# EAGLE design BLEak (EAGLE 7.1.0)
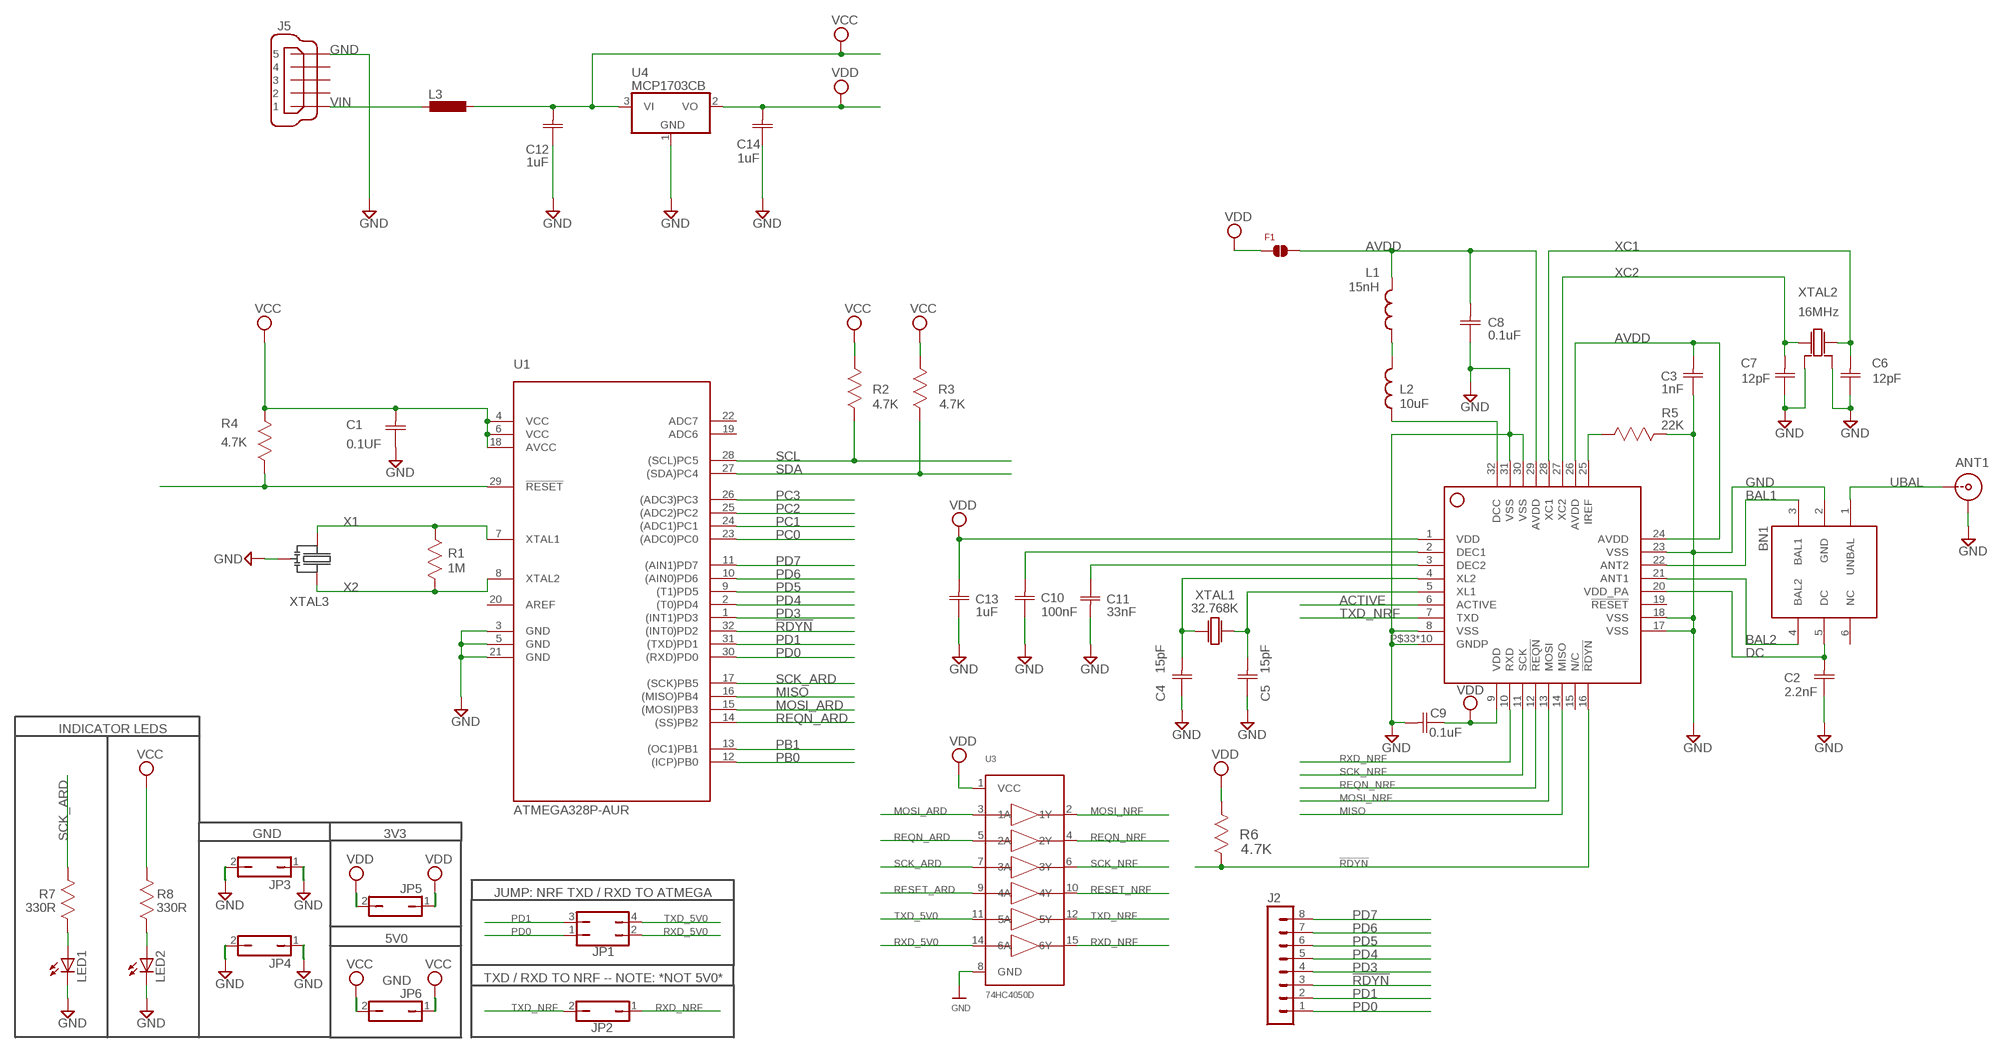
[diagram p0: schematic, sheet 1]

## Parts
ANT1  U.FL-R-SMT(01)  [U.FL]
BN1  2450BM14A0002  [BALUN]
C1  0.1UF  0603ZC104KA72A  [CAPC1608X90N]
C2  2.2nF  C0603C222K5RACTU  [CAPC1608X85N]
C3  1nF  C0603C102J5GACTU  [CAPC1608X85N]
C4  15pF  C0603C150J5GACTU  [CAPC1608X85N]
C5  15pF  C0603C150J5GACTU  [CAPC1608X85N]
C6  12pF  C0603C120J5GACTU  [CAPC1608X85N]
C7  12pF  C0603C120J5GACTU  [CAPC1608X85N]
C8  0.1uF  0603YC104K4T4A  [CAPC1608X90N]
C9  0.1uF  0603YC104K4T4A  [CAPC1608X90N]
C10  100nF  06033C104JAT2A  [CAPC1608X90N]
C11  33nF  C0603C333K5RACTU  [CAPC1608X85N]
C12  1uF  C0805C105K3RACTU  [CAPC2013X140N]
C13  1uF  0603YD105MAT4A  [CAPC1608X90N]
C14  1uF  C0805C105K3RACTU  [CAPC2013X140N]
F1  MMZ1608B121C  [0603]
J2  MA08-1  [MA08-1]
J5  MINI-USB-UX60A-MB-5ST  [UX60A-MB-5ST]
JP1  JP2Q  [JP2Q]
JP2  JP1Q  [JP1]
JP3  JP1Q  [JP1]
JP4  JP1Q  [JP1]
JP5  JP1Q  [JP1]
JP6  JP1Q  [JP1]
L1  15nH  HK100515NJ-T  [0402]
L2  10uF  LBMF1608T100K  [0603]
L3  L-EUL1812  [L1812]
LED1  LEDCHIP-LED0603  [CHIP-LED0603]
LED2  LEDCHIP-LED0603  [CHIP-LED0603]
R1  1M  MC0.063W06031%1M  [RESC1608X60N]
R2  4.7K  MC0.063W06031%4K7  [RESC1608X60N]
R3  4.7K  MC0.063W06031%4K7  [RESC1608X60N]
R4  4.7K  MC0.063W06031%4K7  [RESC1608X60N]
R5  22K  MC0.063W06031%22K  [RESC1608X60N]
R6  4.7K  MC0.063W06031%4K7  [RESC1608X60N]
R7  330R  MC0.063W06031%330R  [RESC1608X60N]
R8  330R  MC0.063W06031%330R  [RESC1608X60N]
U1  ATMEGA328P-AUR  [TQFP-32]
U2  NRF8001  [QFN50P500X500X90-33N]
U3  74HC4050D  74HC4050DTSSOP  [TSSOP16]
U4  MCP1703CB  [SOT23]
XTAL1  32.768K  NX3215SA-32.768K-STD-MUA-9  [3215]
XTAL2  16MHz  TSX-3225-16.0000MF18X-AC3  [3225]
XTAL3  CSTCE16M0V53-R0  [CSTCE16M0V53-R0]

## Nets
!RDYN: J2.3 R6.2(R2) U1.32((INT0)PD2) U2.16(!RDYN)
ACTIVE: U2.6(ACTIVE)
AVDD: C3.2(C2) C8.2(C2) F1.P$2 L1.P$2 U2.24(AVDD) U2.26(AVDD) U2.29(AVDD)
BAL1: BN1.3(BAL1) U2.22(ANT2)
BAL2: BN1.4(BAL2) U2.21(ANT1)
DC: BN1.5(DC) C2.2(C2) U2.20(VDD_PA)
GND: ANT1.2 ANT1.3 BN1.2(GND) C1.1(C1) C2.1(C1) C3.1(C1) C4.1(C1) C5.1(C1) C6.1(C1) C7.1(C1) C8.1(C1) C9.2(C2) C10.1(C1) C11.2(C2) C12.1(C1) C13.1(C1) C14.1(C1) J5.5 JP3.1 JP3.2 JP4.1 JP4.2 LED1.C LED2.C R5.1(R1) U1.3(GND) U1.5(GND) U1.21(GND) U2.8(VSS) U2.17(VSS) U2.18(VSS) U2.23(VSS) U2.30(VSS) U2.31(VSS) U2.P$33(GNDP) U2.P$34(GNDP) U2.P$35(GNDP) U2.P$36(GNDP) U2.P$37(GNDP) U2.P$38(GNDP) U2.P$39(GNDP) U2.P$40(GNDP) U2.P$41(GNDP) U2.P$42(GNDP) U3.8(GND) U4.1(GND) XTAL2.2 XTAL2.4 XTAL3.2
MISO: U1.16((MISO)PB4) U2.14(MISO)
MOSI_ARD: U1.15((MOSI)PB3) U3.3(1A)
MOSI_NRF: U2.13(MOSI) U3.2(1Y)
N$1: R4.2(R2) U1.29(!RESET)
N$4: R5.2(R2) U2.25(IREF)
N$5: C4.2(C2) U2.4(XL2) XTAL1.2
N$7: C5.2(C2) U2.5(XL1) XTAL1.1
N$11: L1.P$1 L2.2
N$12: L2.1 U2.32(DCC)
N$14: C11.1(C1) U2.3(DEC2)
N$15: C10.2(C2) U2.2(DEC1)
N$21: LED2.A R8.2(R2)
N$22: LED1.A R7.2(R2)
PB0: U1.12((ICP)PB0)
PB1: U1.13((OC1)PB1)
PC0: U1.23((ADC0)PC0)
PC1: U1.24((ADC1)PC1)
PC2: U1.25((ADC2)PC2)
PC3: U1.26((ADC3)PC3)
PD0: J2.1 JP1.1 U1.30((RXD)PD0)
PD1: J2.2 JP1.3 U1.31((TXD)PD1)
PD3: J2.4 U1.1((INT1)PD3)
PD4: J2.5 U1.2((T0)PD4)
PD5: J2.6 U1.9((T1)PD5)
PD6: J2.7 U1.10((AIN0)PD6)
PD7: J2.8 U1.11((AIN1)PD7)
REQN_ARD: U3.5(2A)
REQN_NRF: U2.12(!REQN) U3.4(2Y)
RESET_ARD: U3.9(4A)
RESET_NRF: U3.10(4Y)
RXD_5V0: JP1.2 U3.14(6A)
RXD_NRF: JP2.1 U2.10(RXD) U3.15(6Y)
SCK_ARD: R7.1(R1) U1.17((SCK)PB5) U3.7(3A)
SCK_NRF: U2.11(SCK) U3.6(3Y)
SCL: R2.2(R2) U1.28((SCL)PC5)
SDA: R3.2(R2) U1.27((SDA)PC4)
TXD_5V0: JP1.4 U3.11(5A)
TXD_NRF: JP2.2 U2.7(TXD) U3.12(5Y)
UBAL: ANT1.1 BN1.1(UNBAL)
VCC: C1.2(C2) C12.2(C2) JP6.1 JP6.2 L3.1 R2.1(R1) R3.1(R1) R4.1(R1) R8.1(R1) U1.4(VCC) U1.6(VCC) U1.18(AVCC) U4.3(VI)
VDD: C9.1(C1) C13.2(C2) C14.2(C2) F1.P$1 JP5.1 JP5.2 R6.1(R1) U2.1(VDD) U2.9(VDD) U3.1(VCC) U4.2(VO)
VIN: J5.1 L3.2
X1: R1.2(R2) U1.7(XTAL1) XTAL3.1
X2: R1.1(R1) U1.8(XTAL2) XTAL3.3
XC1: C6.2(C2) U2.28(XC1) XTAL2.3
XC2: C7.2(C2) U2.27(XC2) XTAL2.1
Unconnected: BN1.6(NC) J5.2 J5.3 J5.4 U1.14((SS)PB2) U1.19(ADC6) U1.20(AREF) U1.22(ADC7) U2.15(N/C) U2.19(!RESET)

## Notes on the sheet
- INDICATOR LEDS
- GND | 3V3
- JUMP: NRF TXD / RXD TO ATMEGA
- 5V0
- GND | TXD / RXD TO NRF -- NOTE: *NOT 5V0*

## Library data of the parts
ANT1 = U.FL-R-SMT(01):U.FL-R-SMT(01); MANUFACTURER: HIROSE; PARTNO: U.FL-R-SMT(01)
BN1 = 2450BM14A0002:2450BM14A0002; MANUFACTURER: JOHANSON; PARTNO: 2450BM14A0002
C1 = AVX:0603ZC104KA72A: Capacitor, 0603; MPN: 0603ZC104KA72A; OC_FARNELL: -; OC_NEWARK: 55J2765; SUPPLIER: AVX; TOLERANCE: ±10%; VOLTAGERATING: 10V
C2 = Kemet:C0603C222K5RACTU: CAPACITOR, 0603; MPN: C0603C222K5RACTU; OC_FARNELL: 1414624; OC_NEWARK: 64K2852; SUPPLIER: Kemet; TOLERANCE: ±10%; VOLTAGERATING: 50V
C3 = Kemet:C0603C102J5GACTU: CAPACITOR, 0603; MPN: C0603C102J5GACTU; OC_FARNELL: 1414605; OC_NEWARK: 86H9967; SUPPLIER: Kemet; TOLERANCE: ±5%; VOLTAGERATING: 50V
C4 C5 = Kemet:C0603C150J5GACTU: CAPACITOR, 0603; MPN: C0603C150J5GACTU; OC_FARNELL: 1414614; OC_NEWARK: 70K9092; SUPPLIER: Kemet; TOLERANCE: ±5%; VOLTAGERATING: 50V
C6 C7 = Kemet:C0603C120J5GACTU: CAPACITOR, 0603; MPN: C0603C120J5GACTU; OC_FARNELL: 1414612; OC_NEWARK: 19C1214; SUPPLIER: Kemet; TOLERANCE: ±5%; VOLTAGERATING: 50V
C8 C9 = AVX:0603YC104K4T4A: Capacitor, 0603; MPN: 0603YC104K4T4A; OC_FARNELL: 1833863; OC_NEWARK: 85R5663; SUPPLIER: AVX; TOLERANCE: ±10%; VALUE: 0.1UF; VOLTAGERATING: 16V
C10 = AVX:06033C104JAT2A: Capacitor 0603; MPN: 06033C104JAT2A; OC_FARNELL: 1740614; OC_NEWARK: 60R6215; SUPPLIER: AVX; TOLERANCE: ±5%; VOLTAGERATING: 25V
C11 = Kemet:C0603C333K5RACTU: CAPACITOR, 0603; MPN: C0603C333K5RACTU; OC_FARNELL: 1414636; OC_NEWARK: 53M7207; SUPPLIER: Kemet; TOLERANCE: ±10%; VOLTAGERATING: 50V
C12 C14 = Kemet_By_element14_Batch_1:C0805C105K3RACTU: CAPACITOR, 0805; MPN: C0805C105K3RACTU; OC_FARNELL: 1637035; OC_NEWARK: 93K6001; SUPPLIER: Kemet; TOLERANCE: ±10%; VOLTAGERATING: 25V
C13 = AVX:0603YD105MAT4A: Capacitor, 0603; MPN: 0603YD105MAT4A; OC_FARNELL: -; OC_NEWARK: 55J2728; SUPPLIER: AVX; TOLERANCE: ±20%; VALUE: 1UF; VOLTAGERATING: 16V
F1 = MMZ1608B121C:MMZ1608B121C
J2 = con-lstb:MA08-1: PIN HEADER; OC_FARNELL: unknown; OC_NEWARK: unknown
J5 = con-hirose:MINI-USB-: MINI USB Connector Source: http://www.hirose.co.jp/cataloge_hp/e24000019.pdf; OC_FARNELL: unknown; OC_NEWARK: unknown
JP1 = jumper:JP2Q: JUMPER
JP2-JP6 = jumper:JP1Q: JUMPER
L1 = HK100515NJ-T:HK100515NJ-T
L2 = IND:LBMF1608T100K
L3 = rcl:L-EU: INDUCTOR, European symbol
LED1 LED2 = led:LED: LED OSRAM: - CHIPLED LG R971, LG N971, LY N971, LG Q971, LY Q971, LO R971, LY R971 LH N974, LH R974 LS Q976, LO Q976, LY Q976 LO Q996 - Hyper CHIPLED LW Q18S LB Q993, LB Q99A, LB R99A - SideLED LS A670, LO A670, LY A670, LG A670, LP A670 LB A673, LV A673, LT A673, LW A673 LH A674 LY A675 LS A676, LA A676, LO A676, LY A676, LW A676 LS A679, LY A679, LG A679 - Hyper Micro SIDELED® LS Y876, LA Y876, LO Y876, LY Y876 LT Y87S - SmartLED LW L88C, LW L88S LB L89C, LB L89S, LG L890 LS L89K, LO L89K, LY L89K LS L896, LA L896, LO L896, LY L896 - TOPLED LS T670, LO T670, LY T670, LG T670, LP T670 LSG T670, LSP T670, LSY T670, LOP T670, LYG T670 LG T671, LOG T671, LSG T671 LB T673, LV T673, LT T673, LW T673 LH T674 LS T676, LA T676, LO T676, LY T676, LB T676, LH T676, LSB T676, LW T676 LB T67C, LV T67C, LT T67C, LS T67K, LO T67K, LY T67K, LW E67C LS E67B, LA E67B, LO E67B, LY E67B, LB E67C, LV E67C, LT E67C LW T67C LS T679, LY T679, LG T679 LS T770, LO T770, LY T770, LG T770, LP T770 LB T773, LV T773, LT T773, LW T773 LH T774 LS E675, LA E675, LY E675, LS T675 LS T776, LA T776, LO T776, LY T776, LB T776 LHGB T686 LT T68C, LB T68C - Hyper Mini TOPLED® LB M676 - Mini TOPLED Santana® LG M470 LS M47K, LO M47K, LY M47K Source: http://www.osram.convergy.de LUXEON: - LUMILED® LXK2-PW12-R00, LXK2-PW12-S00, LXK2-PW14-U00, LXK2-PW14-V00 LXK2-PM12-R00, LXK2-PM12-S00, LXK2-PM14-U00 LXK2-PE12-Q00, LXK2-PE12-R00, LXK2-PE12-S00, LXK2-PE14-T00, LXK2-PE14-U00 LXK2-PB12-K00, LXK2-PB12-L00, LXK2-PB12-M00, LXK2-PB14-N00, LXK2-PB14-P00, LXK2-PB14-Q00 LXK2-PR12-L00, LXK2-PR12-M00, LXK2-PR14-Q00, LXK2-PR14-R00 LXK2-PD12-Q00, LXK2-PD12-R00, LXK2-PD12-S00 LXK2-PH12-R00, LXK2-PH12-S00 LXK2-PL12-P00, LXK2-PL12-Q00, LXK2-PL12-R00 Source: www.luxeon.com KINGBRIGHT: KA-3528ASYC Source: www.kingbright.com
R1 = Multicomp:MC0.063W06031%1M: RESISTOR, 0603; MPN: MC0.063W06031%1M; OC_FARNELL: 9330410; OC_NEWARK: 38K9946; SUPPLIER: Multicomp; TOLERANCE: 1%; VALUE: 1M Ohms; WATTAGE: 1/16 W
R2-R4 R6 = Multicomp:MC0.063W06031%4K7: RESISTOR, 0603; MPN: MC0.063W06031%4K7; OC_FARNELL: 9331247; OC_NEWARK: -; SUPPLIER: Multicomp; TOLERANCE: 1%; VALUE: 4.7K Ohms; WATTAGE: 1/16 W
R5 = Multicomp:MC0.063W06031%22K: RESISTOR, 0603; MPN: MC0.063W06031%22K; OC_FARNELL: 9330828; OC_NEWARK: 38K9987; SUPPLIER: Multicomp; TOLERANCE: ±1%; VALUE: 22K Ohms; WATTAGE: 1/16 W
R7 R8 = Multicomp:MC0.063W06031%330R: RESISTOR, 0603; MPN: MC0.063W06031%330R; OC_FARNELL: 9331018; OC_NEWARK: -; SUPPLIER: Multicomp; TOLERANCE: ±1%; VALUE: 330 Ohms; WATTAGE: 1/16 W
U1 = ATMEGA328P-AUR:ATMEGA328P-AUR: TQFP - High Performance, Low Power Atmel®AVR® 8-Bit Microcontroller Family; MANUFACTURER: ATMEL; PARTNO: ATMEGA328P-AUR
U2 = NRF8001:NRF8001; MANUFACTURER: NORDIC SEMICONDUCTOR; PARTNO: nRF8001
U3 = microbuilder:74HC4050D: 6-channel level shifter 74HC4050D - 2V-6V Supply SOIC16 Digikey: 74HC4050D,653-ND Mouser: 771-74HC4050D-T TSSOP16 Digikey: 296-9215-1-ND Mouser:
U4 = linear:MCP1703: 250 mA, 16V, Low Quiescent Current LDO Regulator Source: http://ww1.microchip.com/downloads/en/DeviceDoc/22049b.pdf
XTAL1 = XTAL:NX3215SA-32.768K-STD-MUA-9: 32.768K Crystal Oscillator
XTAL2 = XTAL-16MHZ:TSX-3225-16.0000MF18X-AC3: TSX-3225 16.0000MF18X-AC3 16MHz Crystal
XTAL3 = CSTCE16M0V53-R0:CSTCE16M0V53-R0

## Board
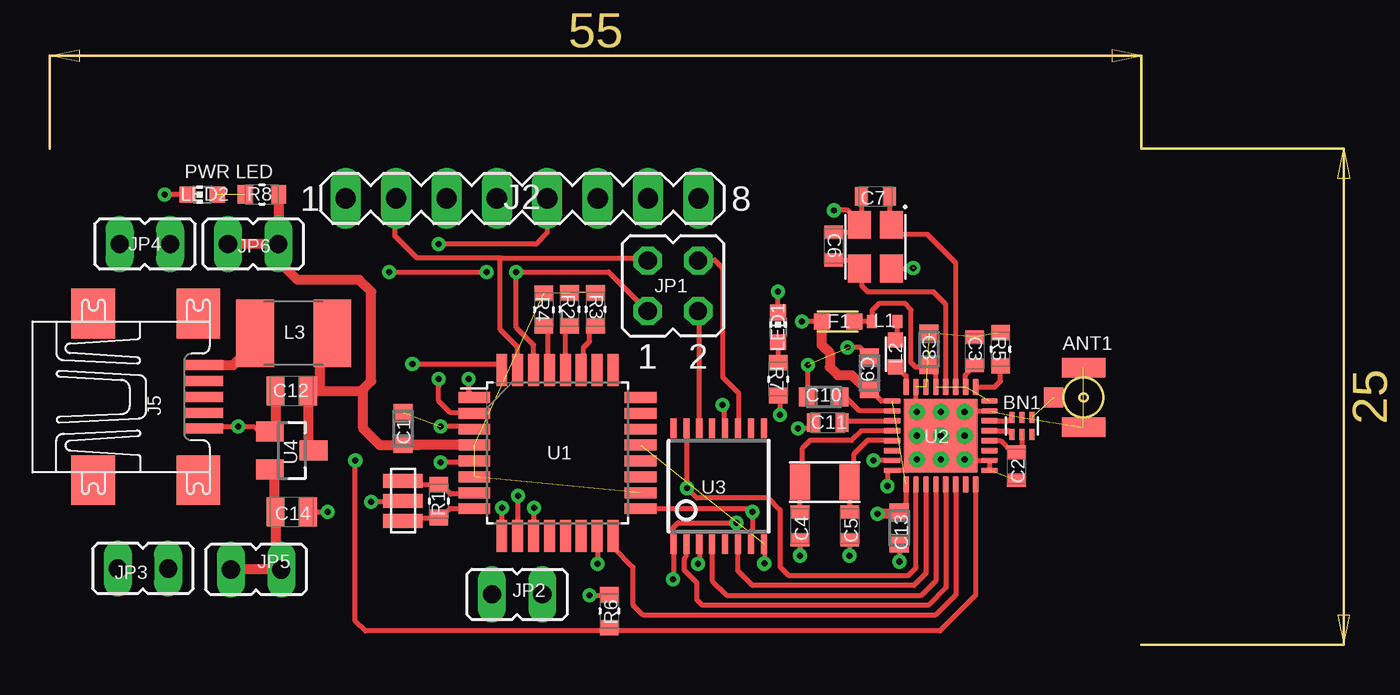
[diagram p1: board, top side]
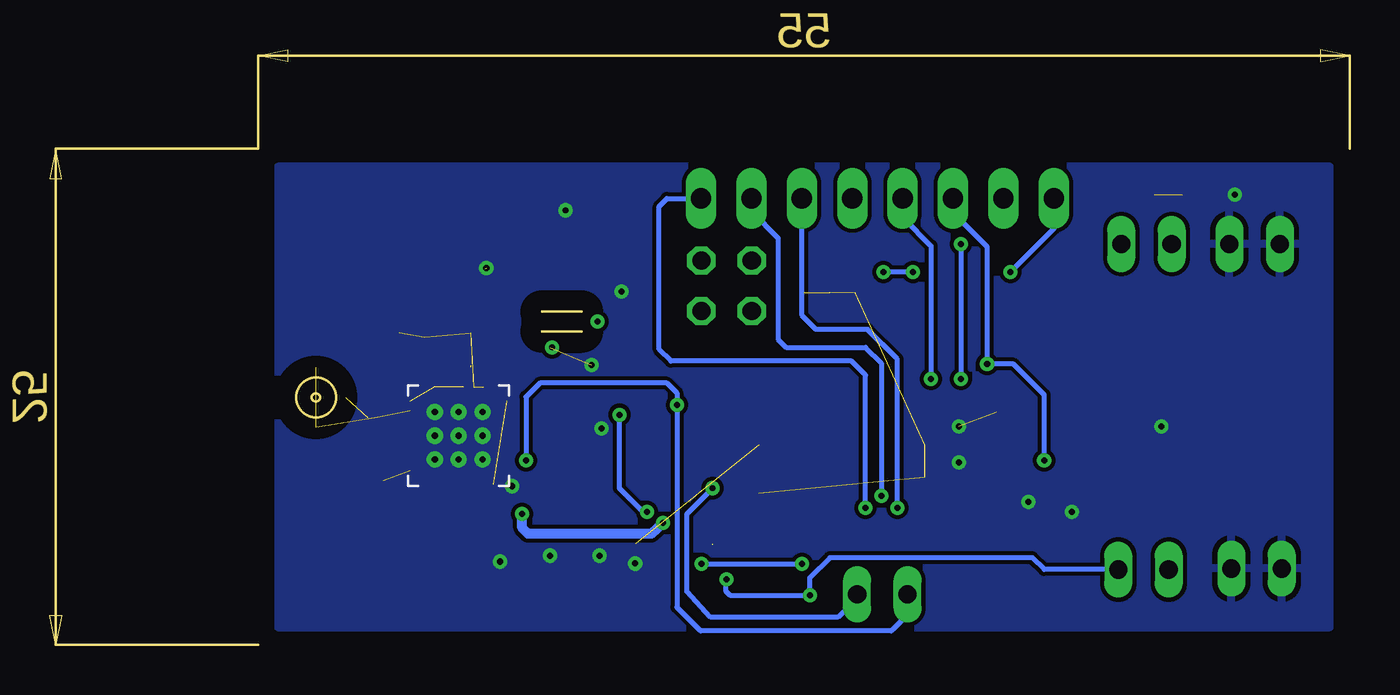
[diagram p2: board, bottom side, seen from below]

Size 14.38 x 5.33 mm. Coordinates in mm from the lower left corner, seen from the top.
Copper layers (1*16): Top 0.035mm / dielectric 1.5mm / Bottom 0.035mm
Design rules "default *": minimum track width 10mil, minimum drill 12mil, track to track 8mil, track to pad 5mil, pad to pad 5mil, via to via 8mil, smd to smd 5mil, copper to edge 40mil, drill to drill 8mil, minimum pad ring 10mil, minimum via ring 8mil, stop-mask expansion 4mil, vias tented up to drill 0mil, thermal gap 10mil

### Footprints (pad centres in the part's own frame; a part is rotated, then mirrored left to right if it is on the bottom)
U.FL = smd 1 x 1: 1 1.5,-1.5 | smd 1 x 2.2: 2 0,0; 3 3,0
BALUN = smd 0.55 x 0.25: 1 0,1; 2 0,0.5; 3 0,0; 4 0.85,0; 5 0.85,0.5; 6 0.85,1
CAPC1608X90N = smd 0.864 x 0.965: 1 -0.813,0; 2 0.813,0
CAPC1608X85N = smd 0.66 x 0.94: 1 -0.711,0; 2 0.711,0
CAPC2013X140N = smd 0.914 x 1.448: 1 -0.813,0; 2 0.813,0
0603 = smd 0.8 x 0.8: P$1 0,0; P$2 1.65,0
MA08-1 = drill 1.016 long: 1 -8.89,0; 2 -6.35,0; 3 -3.81,0; 4 -1.27,0; 5 1.27,0; 6 3.81,0; 7 6.35,0; 8 8.89,0
UX60A-MB-5ST = smd 2 x 0.5: 1 2.25,1.6; 2 2.25,0.8; 3 2.25,0; 4 2.25,-0.8; 5 2.25,-1.6 | smd 2.2 x 2.5: M1 -3.3,-4.2; M2 -3.3,4.2; M3 2,4.2; M4 2,-4.2
JP2Q = drill 0.914 octagon: 1 -1.27,-1.27; 2 1.27,-1.27; 3 -1.27,1.27; 4 1.27,1.27
JP1 = drill 0.914 long: 1 0,-1.27; 2 0,1.27
0402 = smd 0.508 x 0.635: P$1 0,0; P$2 1.27,0
0603' = smd 0.762 x 0.762: 1 0,0; 2 1.372,0
L1812 = smd 1.9 x 3.4: 1 -1.95,0; 2 1.95,0
CHIP-LED0603 = smd 0.8 x 0.8: A 0,-0.75; C 0,0.75
RESC1608X60N = smd 0.762 x 0.94: 1 -0.838,0; 2 0.838,0
TQFP-32 = smd 0.55 x 1.6: 1 -2.8,-4.18; 2 -2,-4.18; 3 -1.2,-4.18; 4 -0.4,-4.18; 5 0.4,-4.18; 6 1.2,-4.18; 7 2,-4.18; 8 2.8,-4.18; 17 2.8,4.18; 18 2,4.18; 19 1.2,4.18; 20 0.4,4.18; 21 -0.4,4.18; 22 -1.2,4.18; 23 -2,4.18; 24 -2.8,4.18 | smd 1.6 x 0.55: 9 4.18,-2.8; 10 4.18,-2; 11 4.18,-1.2; 12 4.18,-0.4; 13 4.18,0.4; 14 4.18,1.2; 15 4.18,2; 16 4.18,2.8; 25 -4.18,2.8; 26 -4.18,2; 27 -4.18,1.2; 28 -4.18,0.4; 29 -4.18,-0.4; 30 -4.18,-1.2; 31 -4.18,-2; 32 -4.18,-2.8
QFN50P500X500X90-33N = smd 0.85 x 0.3: 1 -2.45,1.75; 2 -2.45,1.25; 3 -2.45,0.75; 4 -2.45,0.25; 5 -2.45,-0.25; 6 -2.45,-0.75; 7 -2.45,-1.25; 8 -2.45,-1.75; 17 2.45,-1.75; 18 2.45,-1.25; 19 2.45,-0.75; 20 2.45,-0.25; 21 2.45,0.25; 22 2.45,0.75; 23 2.45,1.25; 24 2.45,1.75 | smd 0.3 x 0.85: 9 -1.75,-2.45; 10 -1.25,-2.45; 11 -0.75,-2.45; 12 -0.25,-2.45; 13 0.25,-2.45; 14 0.75,-2.45; 15 1.25,-2.45; 16 1.75,-2.45; 25 1.75,2.45; 26 1.25,2.45; 27 0.75,2.45; 28 0.25,2.45; 29 -0.25,2.45; 30 -0.75,2.45; 31 -1.25,2.45; 32 -1.75,2.45 | drill 0.305 pad 0.61: P$33 -1.2,1.2; P$34 0,1.2; P$35 1.2,1.2; P$36 -1.2,0; P$37 0,0; P$38 1.2,0; P$39 -1.2,-1.2; P$40 0,-1.2; P$41 1.2,-1.2 | smd 3.7 x 3.7: P$42 0,0
TSSOP16 = smd 0.305 x 0.991: 1 -2.275,-2.918; 2 -1.625,-2.918; 3 -0.975,-2.918; 4 -0.325,-2.918; 5 0.325,-2.918; 6 0.975,-2.918; 7 1.625,-2.918; 8 2.275,-2.918; 9 2.275,2.918; 10 1.625,2.918; 11 0.975,2.918; 12 0.325,2.918; 13 -0.325,2.918; 14 -0.975,2.918; 15 -1.625,2.918; 16 -2.275,2.918
SOT23 = smd 1 x 1.4: 1 -0.95,-1.1; 2 0.95,-1.1; 3 0,1.1
3215 = smd 1 x 1.8: 1 0,0; 2 2.5,0
3225 = smd 1.4 x 1.15: 1 0,1.6; 2 2.2,1.6; 3 2.2,0; 4 0,0
CSTCE16M0V53-R0 = smd 0.7 x 2: 1 -1,0; 2 0,0; 3 1,0

### Placement (x,y rotation side)
ANT1  13.38,2.5 270 top
BN1  9.78,0 270 top
C1  -20.89,-0.56 270 top  (outside the outline)
C2  10,-2.47 90 top
C3  7.9,3.33 270 top
C4  -0.9,-5.47 90 top  (outside the outline)
C5  1.6,-5.47 90 top  (outside the outline)
C6  0.8,8.63 270 top
C7  2.9,11.13 0 top  (outside the outline)
C8  5.6,3.43 270 top
C9  2.6,2.23 90 top
C10  0.3,1.03 0 top
C11  0.5,-0.27 180 top
C12  -26.5,1.33 0 top  (outside the outline)
C13  4.1,-5.57 90 top  (outside the outline)
C14  -26.5,-4.77 180 top  (outside the outline)
F1  0.2,4.83 0 top
J2  -14.9,11.03 0 top  (outside the outline)
J5  -33.2,1.03 0 top  (outside the outline)
JP1  -7.3,6.63 0 top  (outside the outline)
JP2  -15.15,-8.92 90 top  (outside the outline)
JP3  -34,-7.62 270 top  (outside the outline)
JP4  -33.9,8.73 270 top  (outside the outline)
JP5  -28.3,-7.67 270 top  (outside the outline)
JP6  -28.45,8.73 270 top  (outside the outline)
L1  4,4.83 180 top
L2  10uF  [0603']  3.9,2.53 90 top
L3  -26.4,4.23 180 top  (outside the outline)
LED1  -2,4.53 0 top
LED2  -31,11.23 90 top  (outside the outline)
R1  -19.09,-4.22 90 top  (outside the outline)
R2  -12.51,5.44 270 top  (outside the outline)
R3  -11.2,5.44 270 top  (outside the outline)
R4  -13.8,5.43 270 top  (outside the outline)
R5  9.2,3.43 270 top
R6  -10.5,-9.77 270 top  (outside the outline)
R7  -2,1.93 90 top
R8  -28,11.23 180 top  (outside the outline)
U1  -13.12,-1.8 270 top  (outside the outline)
U2  6.19,-0.93 0 top
U3  -5,-3.47 0 top
U4  -26.5,-1.67 270 top  (outside the outline)
XTAL1  1.6,-3.27 180 top  (outside the outline)
XTAL2  2.1,9.7 270 top
XTAL3  -20.9,-4.21 270 top  (outside the outline)

### Tracks (layer width: path | path; a pad name or v marks a point on that pad's centre or on a via)
!RDYN  (via drill 0.3)
  Top 0.254: U2.16 7.94,-8.98 6.16,-10.77 -10.4,-10.77 | -10.4,-10.77 -22.8,-10.77 -23.3,-10.27 v-23.3,-2.17 | R6.2 -10.5,-10.67 -10.4,-10.77 | v-20.43,2.68 -20.42,2.69 -15.92,2.69 U1.32
  Bottom 0.254: v-23.3,-2.17 -23.3,1.13 -21.75,2.68 v-20.43,2.68 -20.43,8.6 -18.71,10.32 J2.3
AVDD  (3 unrouted)
  Top 0.254: F1.P$2 L1.P$2 2.73,5.39 3.07,5.73 4.4,5.73 4.7,5.43 4.7,2.75 4.92,2.53 5,2.53 | U2.29 5.94,2.52 5.01,2.52 5,2.53 | 5.6,2.53 5,2.53 | U2.26 7.44,2.16 C3.2
BAL1
  Top 0.254: U2.22 9.6,-0.18 BN1.3
BAL2
  Top 0.254: U2.21 9.6,-0.68 BN1.4
DC
  Top 0.254: BN1.5 10.28,-1.48 C2.2 9.77,-1.76 9.19,-1.18 U2.20
GND  (via drill 0.3)  (12 unrouted)
  Top 0.254: v3.5,-3.47 3.5,-2.68 U2.8 4.49,-2.68 4.6,-2.57 4.6,-2.52 U2.P$39 | C4.1 v-0.9,-6.97 | C5.1 v1.6,-6.97 | C13.1 v4.1,-7.27 | U3.8 -2.7,-6.39 v-2.7,-7.37 -2.7,-7.47 | C6.1 1.74,9.34 1.9,9.5 | 1.9,9.5 XTAL2.4 2.19,9.79 C7.1 | XTAL2.2 4.87,7.5 4.9,7.53 | C11.2 -0.51,-0.57 v-1,-0.57 | C10.1 -0.5,1.04 v-0.5,2.63 | LED1.C v-2,6.33 | J5.5 -30.85,-0.47 v-29.2,-0.47 -28.4,-0.47 -28.15,-0.72 U4.1 | C14.1 v-24.7,-4.77 | XTAL3.2 -20.96,-4.27 v-22.5,-4.27 | U1.5 -17.37,-2.27 v-19,-2.27 | U1.3 -17.43,-0.47 v-19,-0.47 | C9.2 2.11,3.53 1.6,3.53 | LED2.C v-32.9,11.23 | 1.9,9.5 1.9,10.03 1.5,10.43 v0.8,10.43 | U2.P$39 5,-2.07 5.06,-2.13 U2.P$40 U2.P$41 | U2.P$42 U2.P$38 | U2.P$35 U2.P$38 | U2.P$41 U2.P$38 | U2.P$39 U2.P$36 U2.P$33 4.94,0.32 U2.31 | U2.P$34 U2.P$35 | U2.P$35 7.44,0.32 U2.23 | U2.P$41 7.44,-2.18 U2.18 U2.17
  Top 0.512: C12.1 -27.31,-0.43 U4.1
  other vias: 4.8,7.53
  pour Bottom: -37.7,12.63 15.2,12.63 15.3,12.63 15.3,-10.57 -37.7,-10.57
MISO
  Top 0.254: -10.2,-6.1 U1.16 -10.3,-6 -10.3,-6.55 -9.3,-7.55 -9.3,-9.47 -8.8,-9.97 5.92,-9.97 6.94,-8.94 U2.14
MOSI_ARD  (via drill 0.3)
  Top 0.254: U1.15 -11.1,-5.98 v-11.1,-7.39 -11.1,-7.41 | U3.3 -5.97,-7.35 v-6.03,-7.39
  Bottom 0.254: v-6.03,-7.39 v-11.1,-7.39
MOSI_NRF  (1 unrouted)
  Top 0.254: U2.13 6.46,-3.39 6.46,-8.57 5.56,-9.47 -5.82,-9.47 -6.1,-9.19 -6.1,-8.34 -6.73,-7.71 -6.73,-7.11 -6.65,-7.03 -6.65,-6.46 -6.6,-6.41
N$1
  Top 0.254: U1.29 -13.6,2.46 -13.6,4.39 R4.2
N$3  (via drill 0.3)
  other vias: 1.5,3.53
N$4
  Top 0.254: U2.25 8.89,1.52 9.2,1.83 R5.2
N$5
  Top 0.254: U2.4 2.19,-0.68 1.7,-1.17 -0.4,-1.17 -0.8,-1.57 -0.8,-3.17 XTAL1.2 C4.2
N$7
  Top 0.254: XTAL1.1 C5.2 | U2.5 2.49,-1.18 1.8,-1.87 1.8,-3.07 XTAL1.1 | 1.3,-2.97 XTAL1.1
N$11
  Top 0.254: L2.2 4,4 L1.P$1
N$12
  Top 0.254: U2.32 4.44,2.09 4,2.53 L2.1
N$14
  Top 0.254: U2.3 1.5,-0.18 C11.1
N$15
  Top 0.254: U2.2 2.11,0.32 1.4,1.03 C10.2
N$21  (1 unrouted)
N$22
  Top 0.254: LED1.A R7.2
PD0  (via drill 0.3)
  Top 0.254: U1.30 -14.32,3.65 -15.2,4.53 v-15.2,7.33 -10.54,7.33 JP1.1 | v-21.6,7.33 v-16.7,7.33
  Bottom 0.254: J2.1 -23.79,9.52 v-21.6,7.33 | v-16.7,7.33 v-15.2,7.33
PD1
  Top 0.254: U1.31 -15.12,3.55 -16,4.43 -16,8.03 | -16,8.03 -8.7,8.03 JP1.3 | -16,8.03 -20.2,8.03 -21.3,9.13 -21.3,10.98 J2.2
PD3  (via drill 0.3)
  Top 0.254: v-17.6,1.93 -17.6,1.3 U1.1
  Bottom 0.254: J2.4 -16.2,11 -16.2,10.03 -17.6,8.63 v-17.6,1.93
PD4  (via drill 0.3)
  Top 0.254: J2.5 -13.63,9.3 -14.2,8.73 v-19.1,8.73 | -19.1,1.53 v-19.1,1.93 -19.1,0.83 -18.5,0.23 -17.33,0.23 U1.2
  Bottom 0.254: v-19.1,8.73 v-19.1,1.93
PD5  (via drill 0.3)
  Top 0.254: U1.9 -15.9,-5.98 v-15.9,-4.57
  Bottom 0.254: v-15.9,-4.57 -15.9,2.93 -14.4,4.43 -11.8,4.43 -11.1,5.13 J2.6
PD6  (via drill 0.3)
  Top 0.254: U1.10 -15.1,-5.98 v-15.1,-3.97
  Bottom 0.254: J2.7 -8.55,10.38 -9.9,9.03 -9.9,3.93 -10.3,3.53 -14.3,3.53 -15.1,2.73 v-15.1,-3.97
PD7  (via drill 0.3)
  Top 0.254: U1.11 -14.3,-5.98 v-14.3,-4.57
  Bottom 0.254: v-14.3,-4.57 -14.3,2.13 -13.6,2.83 -4.5,2.83 -3.9,3.43 -3.9,10.63 -4.3,11.03 J2.8
REQN_NRF
  Top 0.254: U2.12 5.97,-3.2 5.97,-8.21 5.21,-8.97 -4.58,-8.97 -5.32,-8.23 U3.4
RXD_5V0
  Top 0.254: U3.14 -5.97,5.36 JP1.2
RXD_NRF  (via drill 0.3)
  Top 0.254: U3.15 -6.62,-3.55 v-6.6,-3.57 -6.1,-4.07 -2.48,-4.07 -1.9,-4.65 -1.9,-7.55 -1.48,-7.97 4.56,-7.97 4.94,-7.58 U2.10
  Bottom 0.254: JP2.1 -13.88,-9.09 -12.9,-10.07 -6.5,-10.07 -5.3,-8.77 -5.3,-4.87 v-6.6,-3.57
SCK_ARD  (via drill 0.3)
  Top 0.254: U1.17 -3.47,-4.6 v-3.3,-4.77 -3.3,-5.67 -3.37,-5.74 U3.7 -3.4,-6.36 | R7.1 -1.9,0.99 v-1.9,0.13
  Bottom 0.254: v-3.3,-4.77 -3.1,-4.77 -1.9,-3.57 v-1.9,0.13
SCK_NRF
  Top 0.254: -4.02,-7.57 U3.6 -4.02,-7.73 -3.28,-8.47 4.85,-8.47 5.44,-7.87 U2.11
SCL
  Top 0.254: U1.28 -12.72,4.39 R2.2
SDA
  Top 0.254: U1.27 -11.92,2.91 -11.8,3.03 -11.8,3.53 -11.5,3.83 -11.5,4.3 R3.2
TXD_5V0
  Top 0.254: JP1.4 -6,7.93 -5.2,7.93 -4.8,7.53 -4.8,2.03 -4,1.23 -4,-0.53 U3.11
TXD_NRF  (via drill 0.3)
  Top 0.254: U2.7 v2.8,-2.17 | U3.12 -4.7,-0.55 -4.7,0.53 arc90 v-4.8,0.63
  Bottom 0.254: v2.8,-2.17 2.8,1.03 2.1,1.73 -4.3,1.73 -4.8,1.23 v-4.8,0.63 -4.8,-9.57 -6,-10.77 -15.6,-10.77 -16.42,-9.95 JP2.2
UBAL  (1 unrouted)
VCC  (5 unrouted)
  Top 0.508: -23,1.33 -22.5,1.83 -22.5,6.33 -23.1,6.93 -26.2,6.93 -27.18,7.91 JP6.2 arc90 -27.16,8.75 R8.1 | -22.07,-1.4 -20.12,-1.4 | -20.12,-1.4 C1.2 | U1.4 -20.12,-1.4
  Top 0.512: L3.1 -25.1,4.23 -25.1,1.33 | -25,-1.47 -25.2,-1.67 U4.3 -25.69,-1.38 C12.2 -25.1,1.33 | -25.1,1.33 -23,1.33 -22.9,1.33 -22.9,-0.57 -22.07,-1.4 | JP6.2 JP6.1
VDD  (via drill 0.3)  (1 unrouted)
  Top 0.254: U2.9 4.44,-4.33 4.1,-4.67 C13.2 | U2.1 3.19,0.82 C9.1 | v-7.3,-8.17 -7.27,-8.14 U3.1 -7.3,-6.36 -7.3,-5.57 -7.04,-5.31 v-4.1,-5.31 | v-11.5,-8.97 -10.54,-8.97 R6.1 | F1.P$1 v-0.8,4.83
  Top 0.508: F1.P$1 0.2,3.63 0.6,3.23 0.6,2.53 1,2.13 1.7,2.13 2.41,1.42 C9.1 | C13.2 3.99,-4.87 v3,-4.87
  Top 0.512: U4.2 -27.55,-2.62 -27.4,-2.77 -27.4,-4.68 C14.2 -27.31,-7.39 JP5.2 JP5.1
  Bottom 0.254: JP5.2 -23.3,-7.67 -22.7,-7.07 -12.5,-7.07 -11.5,-8.07 v-11.5,-8.97 -7.47,-8.97 -7.28,-8.78 -7.28,-8.19 v-7.3,-8.17
  Bottom 0.508: v-4.1,-5.31 -3.5,-5.87 2.7,-5.87 3,-5.57 v3,-4.87 3,-4.77
VIN
  Top 0.512: -28.35,3.03 -28.35,3.73 | -28.35,3.73 L3.2 | J5.1 -29.45,2.63 -28.35,3.73
X1
  Top 0.254: U1.7 -17.33,-3.77 -17.43,-3.87 -18.5,-3.87 -18.99,-3.38 R1.2 | -18.79,-3.38 R1.2 | XTAL3.1 -21.13,-3.38 R1.2
X2
  Top 0.254: XTAL3.3 -21.16,-5.07 -20.3,-5.07 -20.29,-5.06 R1.1 -18.53,-4.6 U1.8
XC1
  Top 0.254: U2.28 6.44,5.69 5.8,6.33 2.5,6.33 2.2,6.63 2.2,7.5 XTAL2.3 1.68,7.92 C6.2
XC2
  Top 0.254: U2.27 6.94,7.79 5.5,9.23 4.5,9.23 4.2,9.23 4.1,9.33 3.93,9.33 XTAL2.1 3.61,9.79 C7.2

### Text on the board
_tNames: PWR LED